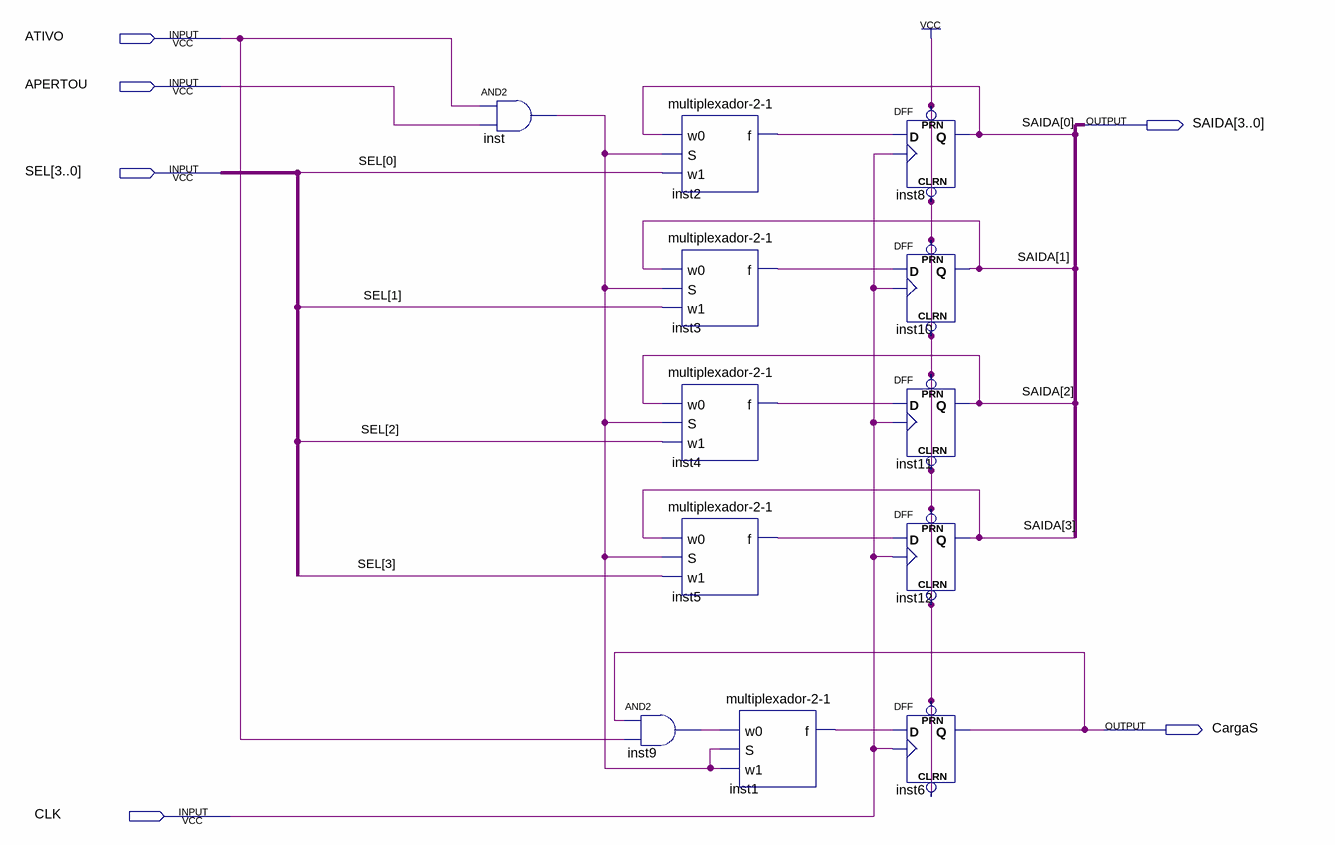
[diagram p0: schematic sheet]
// Quartus schematic controle.bdf as structural Verilog: 12 symbols, 6 pins
module controle (
  input  ATIVO,
  input  APERTOU,
  input  [3:0] SEL,
  input  CLK,
  output [3:0] SAIDA,
  output CargaS
);

  wire inst1_f, inst2_f, inst3_f, inst4_f, inst5_f, inst9_out, inst_out;

  and inst (inst_out, ATIVO, APERTOU);
  \multiplexador-2-1  inst2 (.w0(SAIDA[0]), .S(inst_out), .w1(SEL[0]), .f(inst2_f));
  \multiplexador-2-1  inst3 (.w0(SAIDA[1]), .S(inst_out), .w1(SEL[1]), .f(inst3_f));
  \multiplexador-2-1  inst4 (.w0(SAIDA[2]), .S(inst_out), .w1(SEL[2]), .f(inst4_f));
  \multiplexador-2-1  inst5 (.w0(SAIDA[3]), .S(inst_out), .w1(SEL[3]), .f(inst5_f));
  and inst9 (inst9_out, CargaS, ATIVO);
  \multiplexador-2-1  inst1 (.w0(inst9_out), .S(inst_out), .w1(inst_out), .f(inst1_f));
  DFF inst8 (.CLRN(1'b1), .CLK(CLK), .D(inst2_f), .PRN(1'b1), .Q(SAIDA[0]));
  DFF inst10 (.CLRN(1'b1), .CLK(CLK), .D(inst3_f), .PRN(1'b1), .Q(SAIDA[1]));
  DFF inst11 (.CLRN(1'b1), .CLK(CLK), .D(inst4_f), .PRN(1'b1), .Q(SAIDA[2]));
  DFF inst12 (.CLRN(1'b1), .CLK(CLK), .D(inst5_f), .PRN(1'b1), .Q(SAIDA[3]));
  DFF inst6 (.CLRN(1'b1), .CLK(CLK), .D(inst1_f), .PRN(1'b1), .Q(CargaS));
endmodule
